# Altium schematic sheet Schematic.SchDoc
size A4
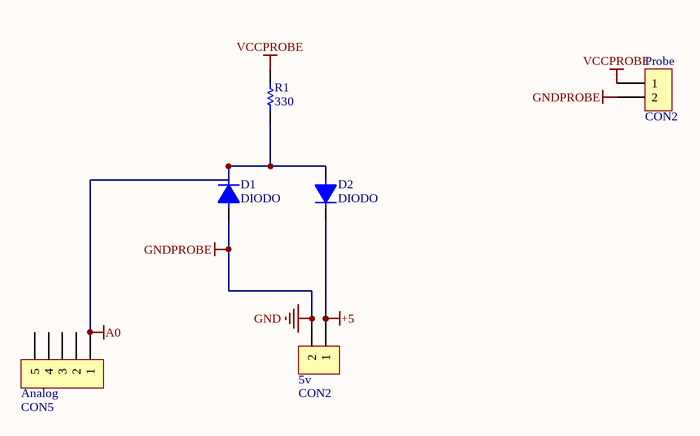
[diagram p0: Schematic.SchDoc]

## Parts
5v  CON2  [SIP2]
Analog  CON5  [SIP5]
D1  DIODO  [DO41]
D2  DIODO  [DO41]
Probe  CON2  [SIP2]
R1  330  [RES400]

## Nets
+5: 5v.1 D2.2
A0: Analog.1 D1.2 D2.1 R1.1
GND: 5v.2 D1.1 Probe.2  [also labelled GNDPROBE]
VCCPROBE: Probe.1 R1.2

Not connected (* = marked no-connect by the designer): Analog 2 3 4 5

## Library data of the parts
R1 = RES